# Altium schematic sheet Sheet6.SchDoc
size A4; SheetNumber: 6; SheetTotal: 6
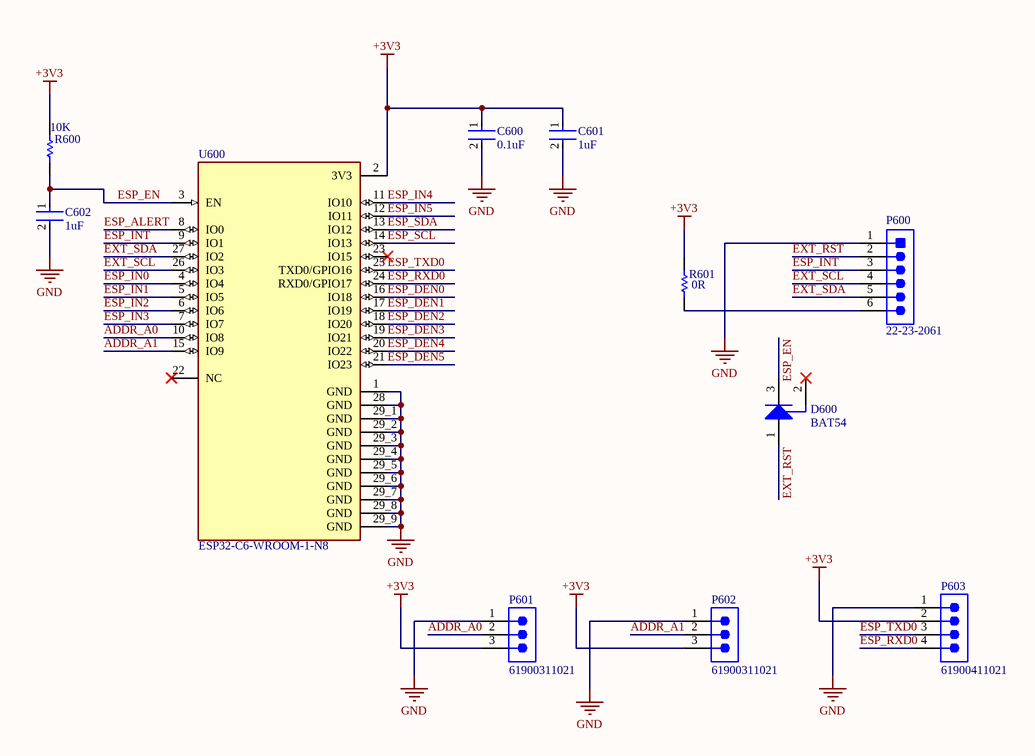
[diagram p0: Sheet6.SchDoc]

## Parts
C600  0.1uF  [FP-GRM155-0_05-IPC_B]
C601  1uF  [FP-GRM15-0_1-MFG]
C602  1uF  [FP-GRM15-0_1-MFG]
D600  BAT54  [INF-SOT23_L]
P600  22-23-2061  [MOLX-22-23-2061_V]
P601  61900311021  [61900311021]
P602  61900311021  [61900311021]
P603  61900411021  [61900411021]
R600  10K  [RESC1005X40X25LL05T10]
R601  0R  [RESC1005X40X25NL05T10]
U600  ESP32-C6-WROOM-1-N8  [ESP32-C6-WROOM-1-N8]

## Nets
+3V3: C600.1 C601.1 P601.3 P602.3 P603.2 R600.2 R601.1 U600.2(3V3)
GND: C600.2 C601.2 C602.2 P600.1 P601.1 P602.1 P603.1 U600.1(GND) U600.28(GND) U600.29_1(GND) U600.29_2(GND) U600.29_3(GND) U600.29_4(GND) U600.29_5(GND) U600.29_6(GND) U600.29_7(GND) U600.29_8(GND) U600.29_9(GND)
ADDR_A0: P601.2 U600.10(IO8)
ADDR_A1: P602.2 U600.15(IO9)
ESP_ALERT: U600.8(IO0)
ESP_DEN0: U600.16(IO18)
ESP_DEN1: U600.17(IO19)
ESP_DEN2: U600.18(IO20)
ESP_DEN3: U600.19(IO21)
ESP_DEN4: U600.20(IO22)
ESP_DEN5: U600.21(IO23)
ESP_EN: C602.1 D600.3(K) R600.1 U600.3(EN)
ESP_IN0: U600.4(IO4)
ESP_IN1: U600.5(IO5)
ESP_IN2: U600.6(IO6)
ESP_IN3: U600.7(IO7)
ESP_IN4: U600.11(IO10)
ESP_IN5: U600.12(IO11)
ESP_INT: P600.3 U600.9(IO1)
ESP_RXD0: P603.4 U600.24(RXD0/GPIO17)
ESP_SCL: U600.14(IO13)
ESP_SDA: U600.13(IO12)
ESP_TXD0: P603.3 U600.25(TXD0/GPIO16)
EXT_RST: D600.1(A) P600.2
EXT_SCL: P600.4 U600.26(IO3)
EXT_SDA: P600.5 U600.27(IO2)
NetP600_6: P600.6 R601.2

Not connected (* = marked no-connect by the designer): D600 2(NC)*; U600 22(NC)* 23(IO15)*

## Library data of the parts
C600 = CMP-2008-04639-2: Chip Multilayer Ceramic Capacitors for General Purpose, 0402, 0.10uF, X7R, 15%, 10%, 50V; Dissipation Factor: 0.025%; Capacitance: 100nF; Weight: 0.000212oz; Thickness: 0.022inch; Voltage Rating (DC): 50V; Dielectric Material: Ceramic; Termination: SMD/SMT; Case/Package: 0402; Case Code (Imperial): 0402; Mount: Surface Mount; REACH SVHC: No SVHC; Resistor Type: Ceramic; Dielectric: X7R; Max Operating Temperature: 125°C; Voltage: 50V; Lead Free: Lead Free; Package Quantity: 10000; Packaging: Tape and Reel; Length: 1mm; Material: Ceramic; Height: 0.5mm; Depth: 0.5mm; Width: 0.5mm; Min Operating Temperature: -55°C; Tolerance: 10%; Case Code (Metric): 1005; Voltage Rating: 50V
C601 C602 = CMP-2008-04556-2: CAP CER 1UF 10V X5R 0402; Manufacturer Part Number: GRM155R61A105KE15D; Manufacturer: Murata; Material: Ceramic; Tolerance: 10%; Temperature Coefficient: 15%; Octopart: https://octopart.com/grm155r61a105ke15d-murata-197442; Lead Free: Yes; ComponentLink2Description: Datasheet; Temperature: -55°C to +85°C; Temperature Range High: +85°C; Height: 0.55mm; Capacitance: 1uF; Ipc Land Pattern Name: CAPC10050X50; ComponentLink2URL: https://search.murata.co.jp/Ceramy/image/img/A01X/G101/ENG/GRM155R61A105KE15-01A.pdf; Temperature Range Low: -55°C; Device Class L2: Capacitors; Voltage Rating: 10V; RoHS: TRUE; Device Class L1: Passive Components; Device Class L3: Ceramic Capacitors; Temperature Characteristic: X5R; Mouser Description: 0402 1 uF 10 V ±10% Tolerance X5R Surface Mount Multilayer Ceramic Capacitor; Automotive: No; Package: GRM15-0.1; Digikey Description: CAP CER 1UF 10V X5R 0402; Value: 1uF; Category: Cap
D600 = CMP-1182-00010-1: Silicon Schottky Diode, SOT23, Reel, Green; Manufacturer: Infineon; VF (max): 800Â mV; Configuration: Single; IF (max): 200Â mA; CT (max): 10Â pF; Green: TRUE; VR (max): 30Â V; PartNumber: BAT54; ComponentLink2URL: http://www.infineon.com/dgdl/bat54series.pdf?folderId=db3a30431400ef68011425f1ca2505e3&fileId=db3a304314dca3890115190b74210ea6; ComponentLink3Description: Package Specification; PackageVersion: Apr-08; PackageDescription: 3-Pin Small Outline Transistor Package, 1.3 x 2.9 mm Body, 0.95 mm Pitch; ComponentLink1Description: Manufacturer URL; ComponentLink1URL: http://www.infineon.com/; Mounting Technology: Surface Mount; Packing: Reel; ComponentLink2Description: Datasheet; PackageReference: SOT23; ComponentLink3URL: http://www.infineon.com/dgdl/SOT23-Package_Overview.pdf?folderId=db3a30431936bc4b0119532290053c66&fileId=db3a30431936bc4b0119533468123c85
P600 = CMP-2000-05536-1: Male Header, Pitch 2.54 mm, 1 x 6 Position, Height 10.67 mm, Tail Length 3.56 mm, 0 to 70 degC, RoHS, Bulk; Manufacturer: Molex; Pitch: 2.54mm; Mounting Angle: Vertical; Current Rating: 4A; Number of Positions / Contacts: 6; Voltage Rating: 250V; Packaging: Bulk; Package Description: Male Header, Pitch 2.54 mm, 1 x 6 Position, Height 10.67 mm, Tail Length 3.56 mm; Number of Rows: 1; Type: PinStrip; Contact Material: Brass; Product Category: .100K.K.Connectors; Factory Pack Quantity: 1000; Mounting Style: ThroughHole; RoHS: Details; Contact Plating: Tin; Housing Material: Nylon; Mounting Technology: ThroughHole; Termination Style: ThroughHole; Tradename: KK; Number of Positions: 6; Brand: Molex; Product Type: Headers; Series: 6373; Datasheet URL: https://datasheet.ciiva.com/19460/232303-19460895.pdf; Package Reference: 22-23-2061; Datasheet Version: Rev. P, 09/2001; Manufacturer URL: http://www.molex.com/
P601 P602 = CMP-1502-00593-3: WR-WTB 2.54mm Male 3Pin Left Angled Header Bottom Locking; Current Rating: 3A; Insulation: Insulated; Insulation Resistance: 1GΩ; Operating Supply Voltage: 250V; Number of Positions: 3; Connector Type: Male Pin; Contact Resistance: 20mΩ; Contact Mating Length: 7.62mm; RoHS: Compliant; Housing Material: Nylon; Termination: Through Hole; Height: 3.3mm; Min Operating Temperature: -40°C; Lead Pitch: 2.54mm; Number of Pins: 3; Pitch: 2.54mm; Packaging: Bulk; Flammability Rating: UL94 V-0; Max Operating Temperature: 105°C; Width: 7.66mm; Gender: Male; Length: 7.62mm; Voltage Rating: 250V; Fastening Type: Friction; Number of Rows: 1; Color: Beige; Mount: Through Hole; Number of Contacts: 3; Contact Gender: Male; Contact Plating: Tin; Contact Material: Copper
P603 = CMP-1502-00594-3: Wr-wtb Series, 2.54MM Pitch 4 Way 1 Row Right Angle Pcb Header, Through Hole; Contact Resistance: 20mΩ; Number of Positions: 4; Insulation: Insulated; Connector Type: Male Pin; Voltage Rating: 250V; Gender: Male; Insulation Resistance: 1GΩ; Current Rating: 3A; Number of Rows: 1; Flammability Rating: UL94 V-0; Pitch: 2.54mm; Housing Material: Nylon; Height: 3.3mm; Length: 10.16mm; Contact Gender: Male; Color: Beige; Contact Mating Length: 7.62mm; Contact Material: Copper; Mount: Through Hole; Number of Pins: 4; Number of Contacts: 4; Fastening Type: Friction; Contact Plating: Tin; Packaging: Bulk; RoHS: Compliant; Lead Pitch: 2.54mm; Min Operating Temperature: -40°C; Termination: Through Hole; Width: 10.2mm; Max Operating Temperature: 105°C; Operating Supply Voltage: 250V
R600 = CMP-2002-07353-1: Part Number: RC0402FR-0710KL; Manufacturer: Yageo / Phycomp
R601 = CMP-1011-00001-2: Manufacturer: Yageo / Phycomp; Part Number: RC0402JR-070RL
U600 = ESP32-C6-WROOM-1-N8: WiFi-Module 802.11 2, 4GHz 150Mb/s; Manufacturer: Espressif Systems; Supplier: DigiKey; Supplier Part Number: 1965-ESP32-C6-WROOM-1-N8CT-ND; Manufacturer Part Number: ESP32-C6-WROOM-1-N8; Category: RF Transceiver Modules and Modems; Stock: 3437; Pricing: 1=5,38, 10=4,66, 25=4,4084, 100=4,0625, 250=3,85516 (USD); ComponentLink1URL: https://datasheet.octopart.com:443/ESP32-C6-WROOM-1-N8-Espressif-Systems-datasheet-188867345.pdf?src-supplier=TME; ComponentLink1Description: https://datasheet.octopart.com:443/ESP32-C6-WROOM-1-N8-Espressif-Systems-datasheet-188867345.pdf?src-supplier=TME; ComponentLink2URL: https://datasheet.octopart.com:443/ESP32-C6-WROOM-1-N8-Espressif-Systems-datasheet-188867343.pdf?src-supplier=TME; ComponentLink2Description: https://datasheet.octopart.com:443/ESP32-C6-WROOM-1-N8-Espressif-Systems-datasheet-188867343.pdf?src-supplier=TME; ComponentLink3URL: https://datasheet.octopart.com:443/ESP32-C6-WROOM-1-N8-Espressif-Systems-datasheet-176782707.pdf?src-supplier=SOS+electronic; ComponentLink3Description: https://datasheet.octopart.com:443/ESP32-C6-WROOM-1-N8-Espressif-Systems-datasheet-176782707.pdf?src-supplier=SOS+electronic